# EAGLE design BEACON (EAGLE 9.0.1)
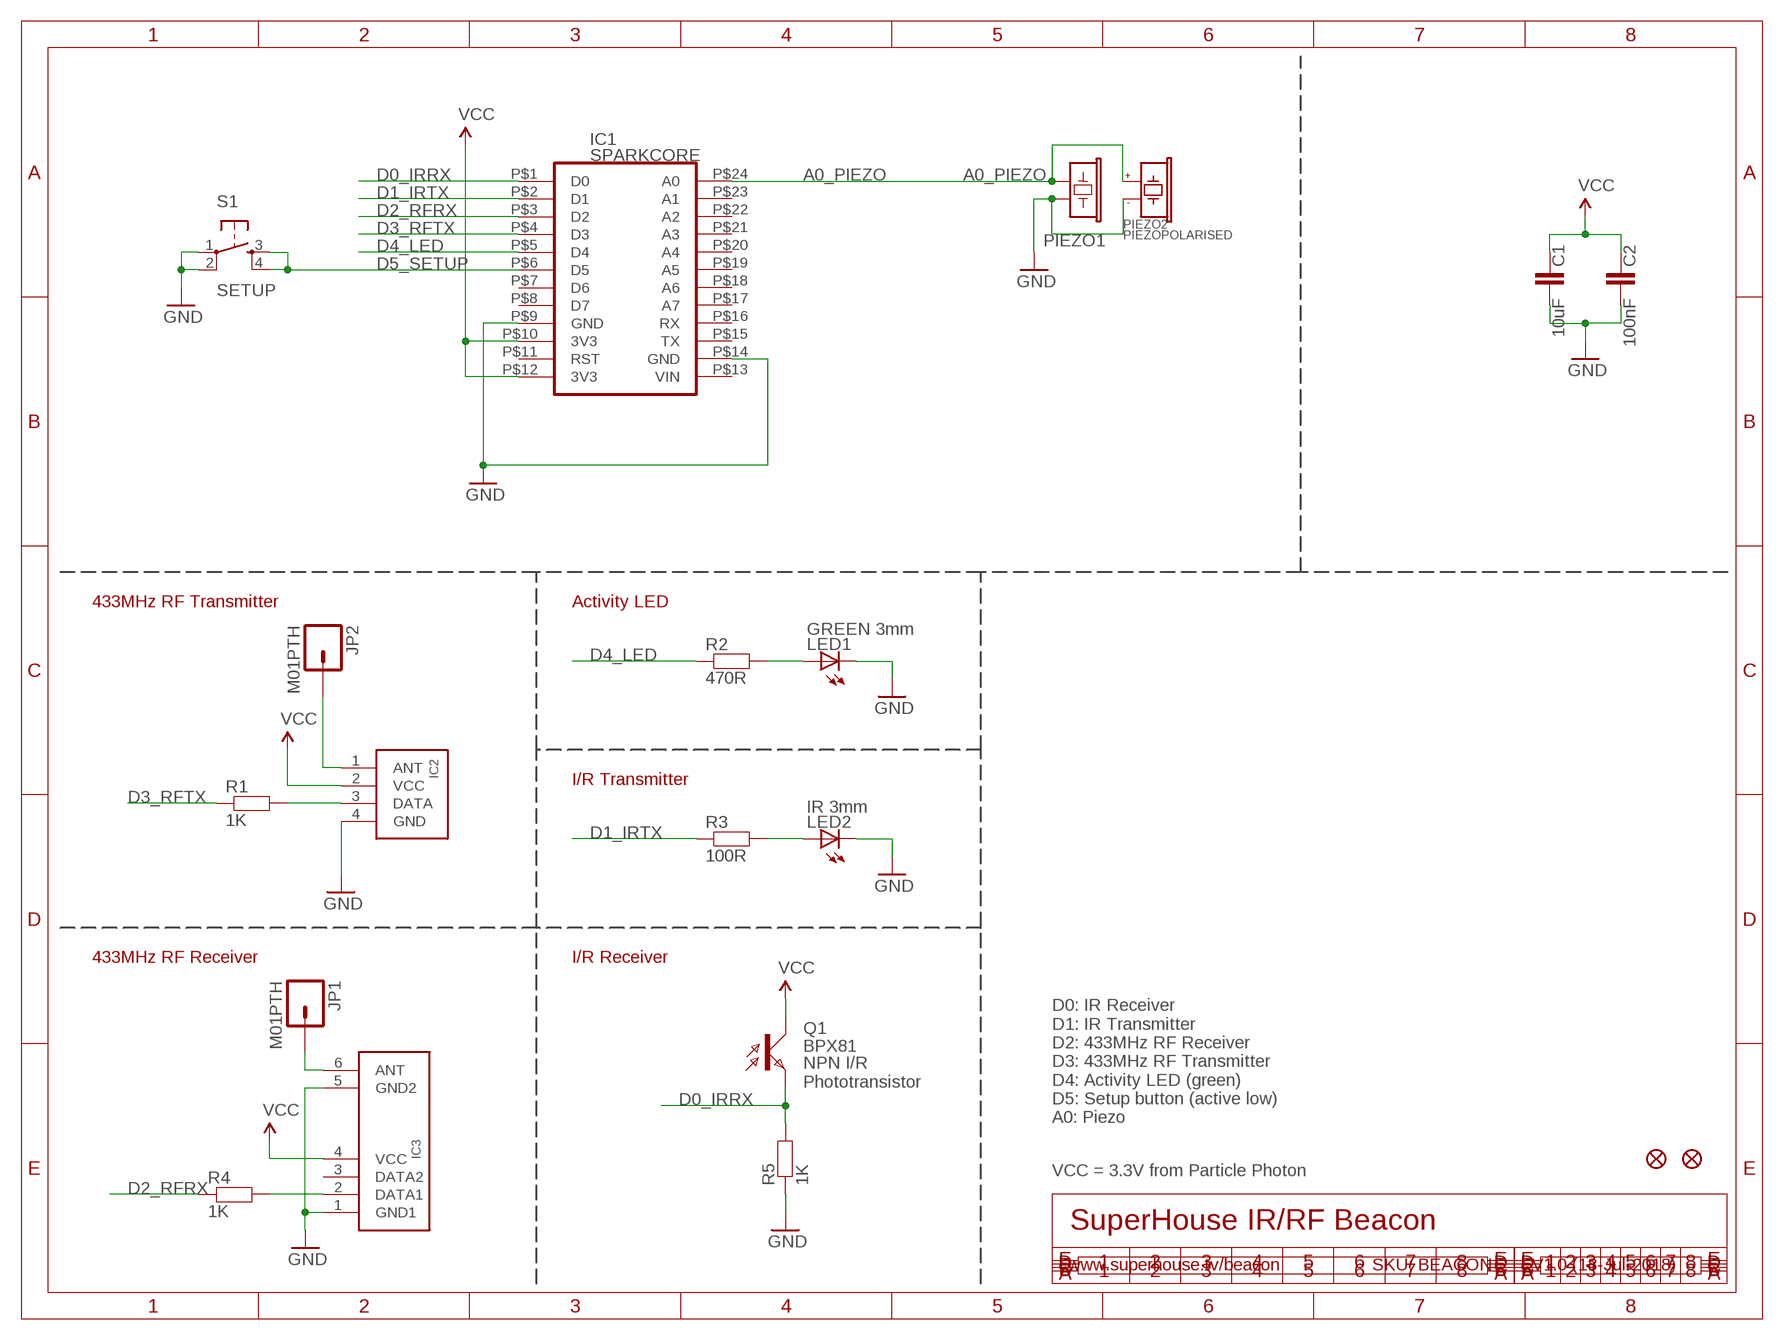
[diagram p0: schematic, sheet 1]

## Parts
C1  10uF  C-EUC0805  [C0805]
C2  100nF  CAP0603  [0603]
IC1  SPARKCORE  [SPARKCORE]
IC2  TX-C1FLAT  [TX-C1-FLAT]
IC3  RXB1SHORTFLAT  [RX-B1-SHORT-FLAT]
JP1  M01PTH  [1X01]
JP2  M01PTH  [1X01]
LED1  GREEN 3mm  LED3MM  [LED3MM]
LED2  IR 3mm  LED3MM  [LED3MM]
PIEZO1  BUZZERSMD12X12  [BUZZER-12X12-SMT]
PIEZO2  PIEZOPOLARISED  [PIEZO12MMWIDEPOLARISED]
Q1  BPX81  [BPX81]
R1  1K  RESISTOR0603  [0603]
R2  470R  RESISTOR0603  [0603]
R3  100R  RESISTOR0603  [0603]
R4  1K  RESISTOR0603  [0603]
R5  1K  RESISTOR0603  [0603]
S1  SETUP  TAC_SWITCHPTH  [TACTILE-PTH]
U$4  FIDUCIAL1X2.5  [FIDUCIAL-1X2.5]
U$5  FIDUCIAL1X2.5  [FIDUCIAL-1X2.5]

## Nets
A0_PIEZO: IC1.P$24(A0) PIEZO1.1 PIEZO2.1(+)
D0_IRRX: IC1.P$1(D0) Q1.E R5.2
D1_IRTX: IC1.P$2(D1) R3.1
D2_RFRX: IC1.P$3(D2) R4.1
D3_RFTX: IC1.P$4(D3) R1.1
D4_LED: IC1.P$5(D4) R2.1
D5_SETUP: IC1.P$6(D5) S1.3 S1.4
GND: C1.1 C2.2 IC1.P$9(GND) IC1.P$14(GND) IC2.4(GND) IC3.1(GND1) IC3.5(GND2) LED1.K(C) LED2.K(C) PIEZO1.2 PIEZO2.2(-) R5.1 S1.1 S1.2
N$1: LED1.A R2.2
N$2: IC2.3(DATA) R1.2
N$3: LED2.A R3.2
N$4: IC2.1(ANT) JP2.1
N$9: IC3.6(ANT) JP1.1
N$13: IC3.2(DATA1) R4.2
VCC: C1.2 C2.1 IC1.P$10(3V3) IC1.P$12(3V3) IC2.2(VCC) IC3.4(VCC) Q1.C
Unconnected: IC1.P$7(D6) IC1.P$8(D7) IC1.P$11(RST) IC1.P$13(VIN) IC1.P$15(TX) IC1.P$16(RX) IC1.P$17(A7) IC1.P$18(A6) IC1.P$19(A5) IC1.P$20(A4) IC1.P$21(A3) IC1.P$22(A2) IC1.P$23(A1) IC3.3(DATA2)

## Notes on the sheet
- 433MHz RF Transmitter | Activity LED
- I/R Transmitter
- 433MHz RF Receiver | I/R Receiver
- NPN I/R
  Phototransistor
- D0: IR Receiver
  D1: IR Transmitter
  D2: 433MHz RF Receiver
  D3: 433MHz RF Transmitter
  D4: Activity LED (green)
  D5: Setup button (active low)
  A0: Piezo
- VCC = 3.3V from Particle Photon
- SuperHouse IR/RF Beacon
- www.superhouse.tv/beacon | SKU: BEACON | V1.0 (18-Jul-2018)

## Library data of the parts
C1 = freetronics-jon:C-EU: CAPACITOR, European symbol
C2 = freetronics:CAP: Capacitor Standard 0603 ceramic capacitor, and 0.1" leaded capacitor.
IC1 = freetronics-jon:SPARKCORE
IC2 = freetronics-jon:TX-C1
IC3 = freetronics-jon:RXB1SHORT
JP1 JP2 = freetronics-original:M01: Header 1 Standard 1-pin 0.1" header. Use with straight break away headers (SKU : PRT-00116), right angle break away headers (PRT-00553), swiss pins (PRT-00743), machine pins (PRT-00117), and female headers (PRT-00115).
LED1 LED2 = freetronics-2:LED: LEDs Standard schematic elements and footprints for 5mm, 3mm, 1206, and 0603 sized LEDs. 5mm - Spark Fun Electronics SKU : COM-00529 (and others)
PIEZO1 = freetronics-master-v1:BUZZER: Buzzer - Piezo Transducer
PIEZO2 = freetronics-jon:PIEZOPOLARISED
Q1 = opto-trans-siemens:BPX81: PHOTO TRANSISTOR; OC_FARNELL: unknown; OC_NEWARK: unknown
R1-R5 = freetronics-jon:RESISTOR: Resistor Basic schematic elements and footprints for 0603, 1206, and PTH 1/10th watt (small) resistors.
S1 = freetronics-original:TAC_SWITCH: Momentary Switch Button commonly used for reset or general input. Spark Fun Electronics SKU : COM-00097
U$4 U$5 = freetronics-original:FIDUCIAL: Fiducial Alignment Points Various fiducial points for machine vision alignment.

## Net classes
1 VCC: width 0.305 mm

## Board
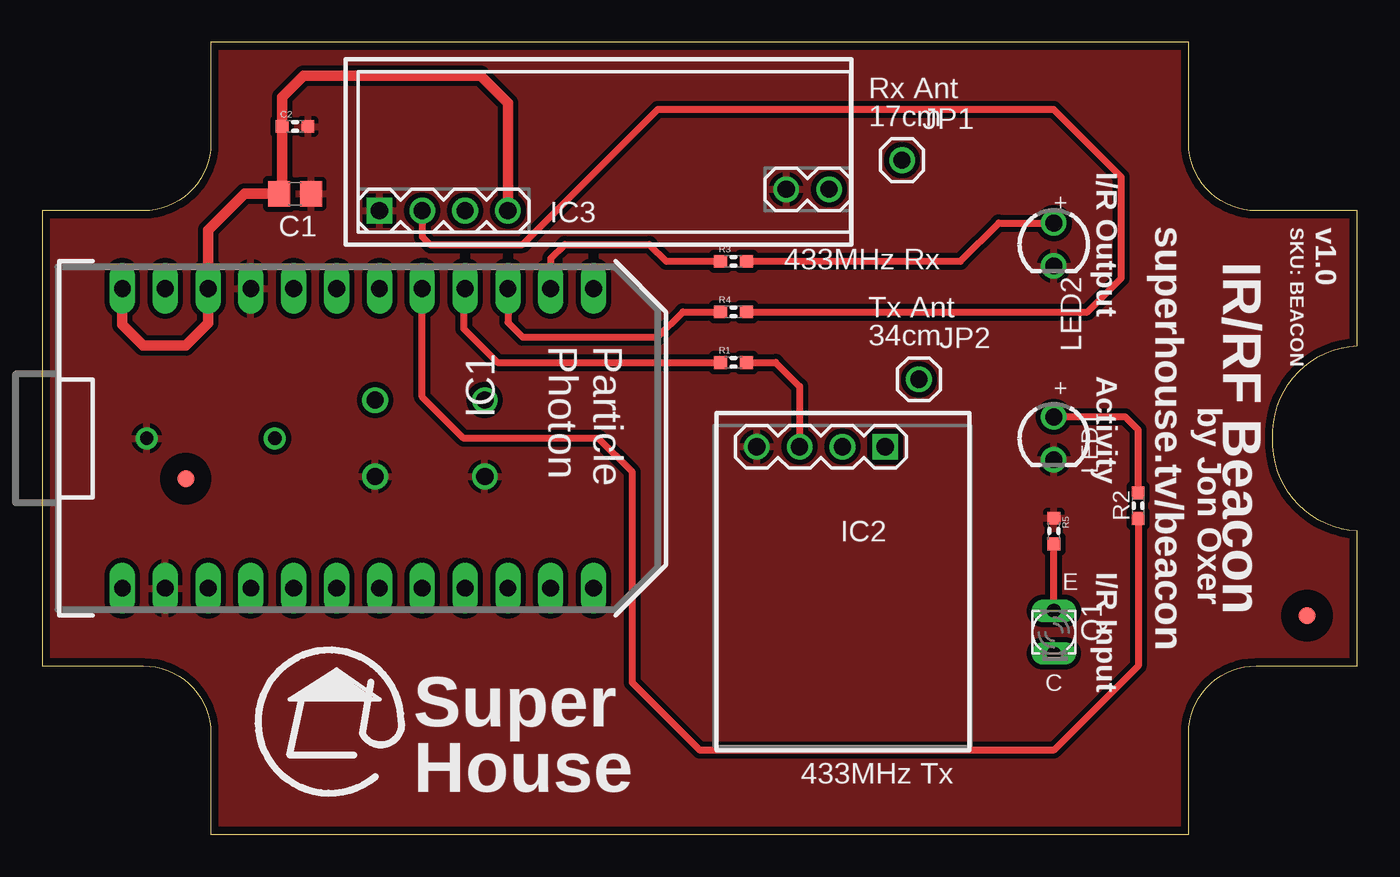
[diagram p1: board, top side]
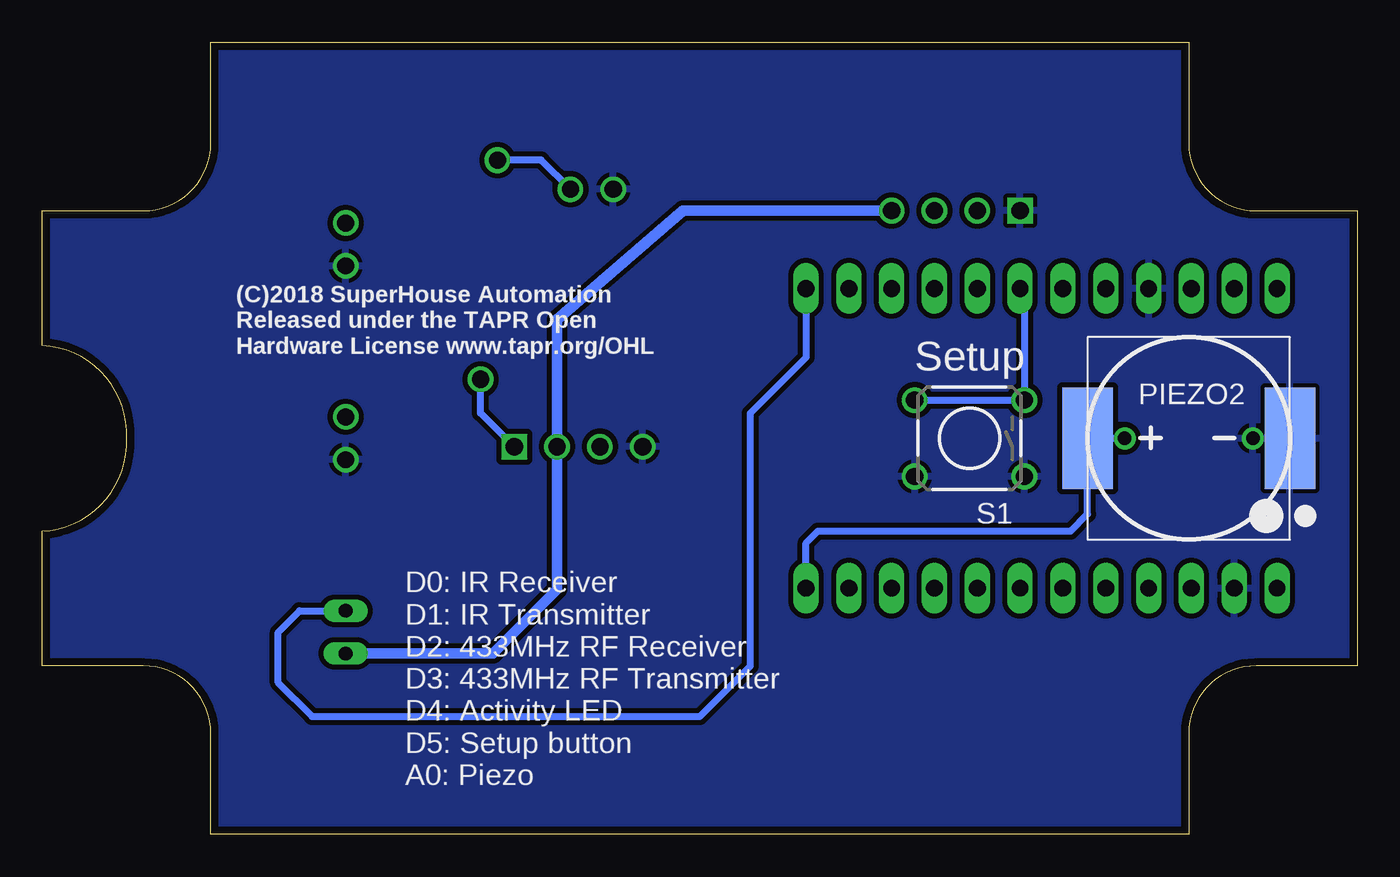
[diagram p2: board, bottom side, seen from below]

Size 78 x 47 mm. Coordinates in mm from the lower left corner, seen from the top.
Outline: 0,10 6,10 arc-90 10,6 10,0 68,0 68,6 arc-90 72,10 78,10 78,18 arc-90 73,23.5 arc-90 78,29 78,37 72,37 arc-90 68,41 68,47 10,47 10,41 arc-90 6,37 0,37 0,10
Copper layers (1*16): Top 0.035mm / dielectric 1.5mm / Bottom 0.035mm
Design rules "default *": minimum track width 10mil, minimum drill 24mil, track to track 12mil, track to pad 12mil, pad to pad 12mil, via to via 12mil, smd to smd 8mil, copper to edge 18mil, drill to drill 8mil, minimum pad ring 10mil, minimum via ring 8mil, stop-mask expansion 4mil, vias tented up to drill 0mil, thermal gap 10mil
tRestrict: area 7.5,20.1 to 9.5,22.1; area 74,12 to 76,14

### Footprints (pad centres in the part's own frame; a part is rotated, then mirrored left to right if it is on the bottom)
C0805 = smd 1.3 x 1.5: 1 -0.95,0; 2 0.95,0
0603 = smd 0.762 x 0.762: 1 -0.762,0; 2 0.762,0
SPARKCORE = drill 1 long: P$1 -8.89,12.7; P$2 -8.89,10.16; P$3 -8.89,7.62; P$4 -8.89,5.08; P$5 -8.89,2.54; P$6 -8.89,0; P$7 -8.89,-2.54; P$8 -8.89,-5.08; P$9 -8.89,-7.62; P$10 -8.89,-10.16; P$11 -8.89,-12.7; P$12 -8.89,-15.24; P$13 8.89,-15.24; P$14 8.89,-12.7; P$15 8.89,-10.16; P$16 8.89,-7.62; P$17 8.89,-5.08; P$18 8.89,-2.54; P$19 8.89,0; P$20 8.89,2.54; P$21 8.89,5.08; P$22 8.89,7.62; P$23 8.89,10.16; P$24 8.89,12.7
TX-C1-FLAT = drill 1.016 square: 1 0,0 | drill 1.016: 2 2.54,0; 3 5.08,0; 4 7.62,0
RX-B1-SHORT-FLAT = drill 1.016 square: 1 0,0 | drill 1.016: 2 2.54,0; 3 5.08,0; 4 7.62,0; 5 24.13,1.27; 6 26.67,1.27
1X01 = drill 1.016: 1 0,0
LED3MM = drill 1: A -1.27,0; K 1.27,0
BUZZER-12X12-SMT = smd 3 x 6: 1 -6,0; 2 6,0
PIEZO12MMWIDEPOLARISED = drill 0.8: 1 -3.8,0; 2 3.8,0
BPX81 = drill 0.813 long: C 1.27,0; E -1.27,0
TACTILE-PTH = drill 1.016: 1 -3.251,2.261; 2 3.251,2.261; 3 -3.251,-2.261; 4 3.251,-2.261
FIDUCIAL-1X2.5 = smd 1 x 1: 1 0,0

### Placement (x,y rotation side)
C1  15,38 180 top
C2  15,42 0 top
IC1  20,23.5 270 top
IC2  50,23 180 top
IC3  20,37 0 top
JP1  51,40 0 top
JP2  52,27 0 top
LED1  60,23.5 270 top
LED2  60,35 270 top
PIEZO1  10,23.5 0 bottom
PIEZO2  10,23.5 0 bottom
Q1  60,12 270 top
R1  41,28 0 top
R2  65,19.5 90 top
R3  41,34 0 top
R4  41,31 0 top
R5  60,18 270 top
S1  23,23.5 180 bottom
U$4  8.51,21.11 270 top
U$5  75.01,12.99 270 top

### Tracks (layer width: path | path; a pad name or v marks a point on that pad's centre or on a via)
A0_PIEZO
  Bottom 0.406: PIEZO2.1 PIEZO1.1 16,19 17,18 32,18 32.7,17.3 IC1.P$24
D0_IRRX
  Top 0.406: Q1.E R5.2
  Bottom 0.406: IC1.P$1 32.7,28.3 36,25 36,10 39,7 62,7 64,9 64,12 62.73,13.27 Q1.E
D1_IRTX
  Top 0.406: IC1.P$2 30.16,34.16 31,35 36,35 37,34 R3.1
D2_RFRX
  Top 0.406: IC1.P$3 27.62,30.38 28.5,29.5 36.5,29.5 38,31 R4.1
D3_RFTX
  Top 0.406: IC1.P$4 25,32.81 25,30 27,28 R1.1
D4_LED
  Top 0.406: IC1.P$5 22.54,25.96 25,23.5 33,23.5 35,21.5 35,9 39,5 60,5 65,10 R2.1
D5_SETUP
  Bottom 0.406: S1.4 S1.3 19.75,32.64 IC1.P$6
GND
  pour Bottom: 0,10 0,37 6,37 arc90 10,41 10,47 68,47 68,41 arc90 72,37 78,37 78,29 arc90 73,23.5 arc90 78,18 78,10 72,10 arc90 68,6 68,0 10,0 10,6 arc90 6,10
  pour Top: 0,10 0,37 6,37 arc90 10,41 10,47 68,47 68,41 arc90 72,37 78,37 78,29 arc90 73,23.5 arc90 78,18 78,10 72,10 arc90 68,6 68,0 10,0 10,6 arc90 6,10
N$1
  Top 0.406: R2.2 65,24 64.23,24.77 LED1.A
N$2
  Top 0.406: 44.92,22.92 IC2.3 44.92,26.58 43.5,28 R1.2
N$3
  Top 0.406: LED2.A 56.73,36.27 54.46,34 R3.2
N$4
  Bottom 0.406: IC2.1 52,25 JP2.1
N$9
  Bottom 0.406: IC3.6 48.4,40 JP1.1
N$13
  Top 0.406: IC3.2 22.54,35.46 23,35 28.5,35 36.5,43 60,43 64,39 64,33 62,31 R4.2
VCC
  Top 0.61: IC1.P$12 4.76,30.24 6,29 8.5,29 9.84,30.34 IC1.P$10 9.84,35.84 12,38 C1.2 14.24,38.19 C2.1 14.24,43.74 15.5,45 26,45 27.62,43.38 IC3.4
  Bottom 0.61: Q1.C 51.27,10.73 47.46,14.54 IC2.2 47.46,30.54 40,37 IC3.4

### Text on the board
tPlace: Rx Ant / 17cm | + | SKU: BEACON | v1.0 | I/R Output | 433MHz Rx | Particle / Photon | Tx Ant / 34cm | + | Activity | superhouse.tv/beacon | IR/RF Beacon | by Jon Oxer | E | I/R Input | C | 433MHz Tx | Super / House
bPlace: Setup | (C)2018 SuperHouse Automation / Released under the TAPR Open / Hardware License www.tapr.org/OHL | D0: IR Receiver / D1: IR Transmitter / D2: 433MHz RF Receiver / D3: 433MHz RF Transmitter / D4: Activity LED / D5: Setup button / A0: Piezo